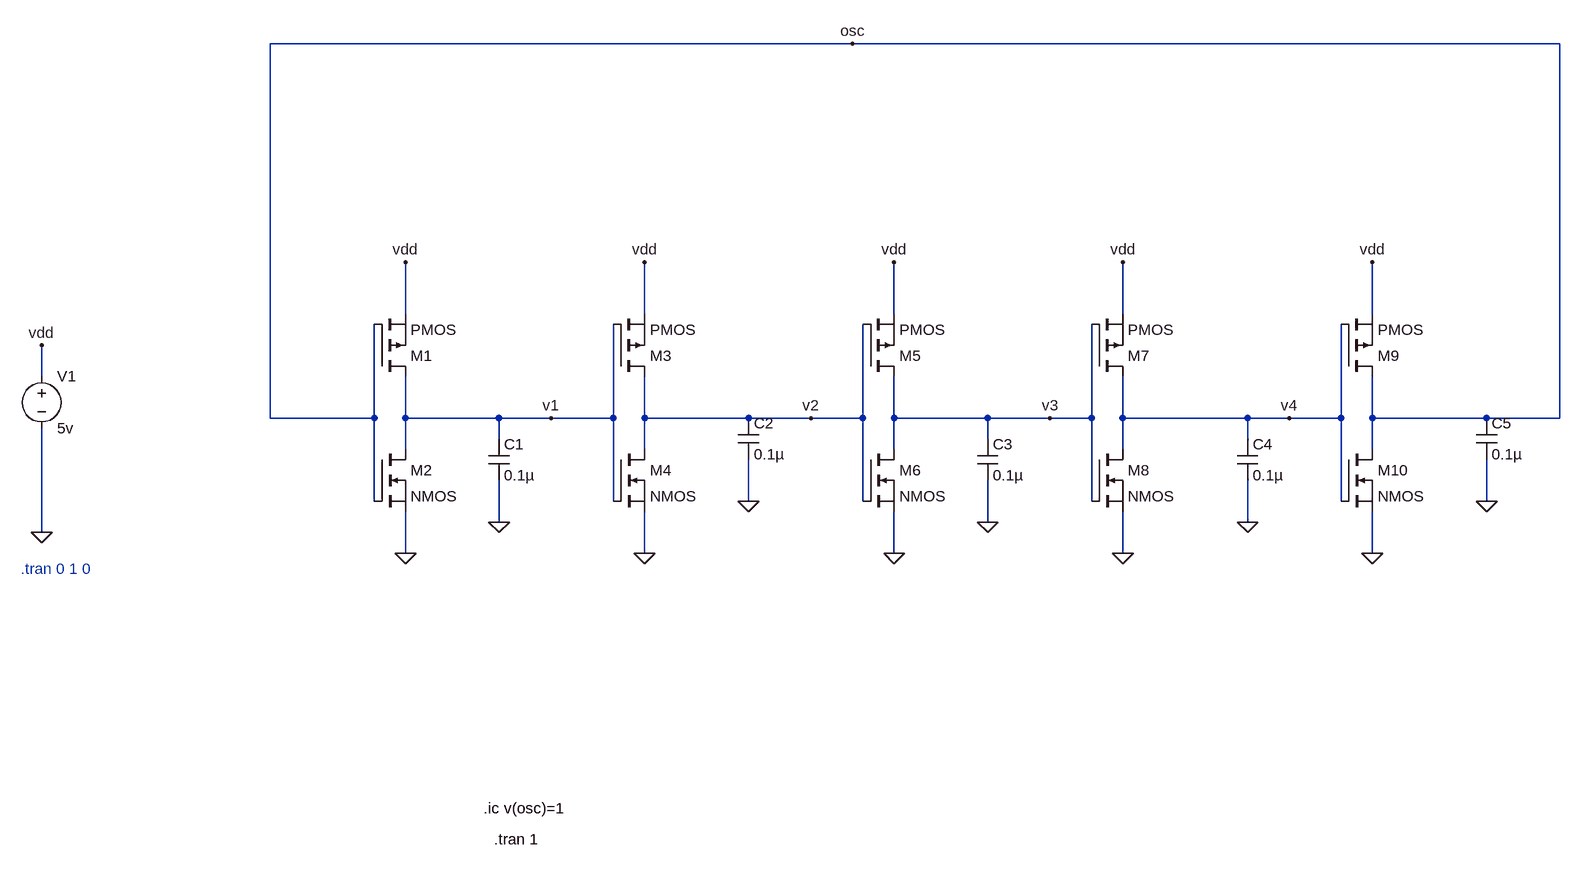
[diagram p0: schematic Ring Oscillator.asc]
Ring Oscillator.asc, the LTspice schematic file:
Version 4
SHEET 1 1428 980
WIRE 320 -384 -576 -384
WIRE 1408 -384 320 -384
WIRE -368 32 -368 -48
WIRE 0 32 0 -48
WIRE 384 32 384 -48
WIRE 736 32 736 -48
WIRE 1120 32 1120 -48
WIRE -928 128 -928 80
WIRE -576 192 -576 -384
WIRE -416 192 -416 48
WIRE -416 192 -576 192
WIRE -368 192 -368 128
WIRE -224 192 -368 192
WIRE -144 192 -224 192
WIRE -48 192 -48 48
WIRE -48 192 -144 192
WIRE 0 192 0 128
WIRE 160 192 0 192
WIRE 256 192 160 192
WIRE 336 192 336 48
WIRE 336 192 256 192
WIRE 384 192 384 128
WIRE 528 192 384 192
WIRE 624 192 528 192
WIRE 688 192 688 48
WIRE 688 192 624 192
WIRE 736 192 736 128
WIRE 928 192 736 192
WIRE 992 192 928 192
WIRE 1072 192 1072 48
WIRE 1072 192 992 192
WIRE 1120 192 1120 128
WIRE 1296 192 1120 192
WIRE 1408 192 1408 -384
WIRE 1408 192 1296 192
WIRE -224 224 -224 192
WIRE 528 224 528 192
WIRE 928 224 928 192
WIRE -368 240 -368 192
WIRE 0 240 0 192
WIRE 384 240 384 192
WIRE 736 240 736 192
WIRE 1120 240 1120 192
WIRE -416 320 -416 192
WIRE -48 320 -48 192
WIRE 160 320 160 256
WIRE 336 320 336 192
WIRE 688 320 688 192
WIRE 1072 320 1072 192
WIRE 1296 320 1296 256
WIRE -224 352 -224 288
WIRE 528 352 528 288
WIRE 928 352 928 288
WIRE -928 368 -928 208
WIRE -368 400 -368 336
WIRE 0 400 0 336
WIRE 384 400 384 336
WIRE 736 400 736 336
WIRE 1120 400 1120 336
FLAG -368 400 0
FLAG -368 -48 vdd
FLAG -928 368 0
FLAG 0 400 0
FLAG 0 -48 vdd
FLAG 384 400 0
FLAG 384 -48 vdd
FLAG 736 400 0
FLAG 736 -48 vdd
FLAG 1120 400 0
FLAG 1120 -48 vdd
FLAG -928 80 vdd
FLAG 320 -384 osc
FLAG -224 352 0
FLAG 160 320 0
FLAG 528 352 0
FLAG 928 352 0
FLAG 1296 320 0
FLAG -144 192 v1
FLAG 256 192 v2
FLAG 624 192 v3
FLAG 992 192 v4
SYMBOL pmos -416 128 M180
SYMATTR InstName M1
SYMBOL nmos -416 240 R0
SYMATTR InstName M2
SYMBOL voltage -928 112 R0
WINDOW 123 0 0 Left 0
WINDOW 39 0 0 Left 0
SYMATTR InstName V1
SYMATTR Value 5v
SYMBOL pmos -48 128 M180
SYMATTR InstName M3
SYMBOL nmos -48 240 R0
SYMATTR InstName M4
SYMBOL pmos 336 128 M180
SYMATTR InstName M5
SYMBOL nmos 336 240 R0
SYMATTR InstName M6
SYMBOL pmos 688 128 M180
SYMATTR InstName M7
SYMBOL nmos 688 240 R0
SYMATTR InstName M8
SYMBOL pmos 1072 128 M180
SYMATTR InstName M9
SYMBOL nmos 1072 240 R0
SYMATTR InstName M10
SYMBOL cap -240 224 R0
SYMATTR InstName C1
SYMATTR Value 0.1µ
SYMBOL cap 144 192 R0
SYMATTR InstName C2
SYMATTR Value 0.1µ
SYMBOL cap 512 224 R0
SYMATTR InstName C3
SYMATTR Value 0.1µ
SYMBOL cap 912 224 R0
SYMATTR InstName C4
SYMATTR Value 0.1µ
SYMBOL cap 1280 192 R0
SYMATTR InstName C5
SYMATTR Value 0.1µ
TEXT -960 424 Left 2 ;.tran 0 1 0
TEXT -248 792 Left 2 !.ic v(osc)=1
TEXT -232 840 Left 2 !.tran 1

The netlist it stands for:
* Ring Oscillator.asc
M1 v1 osc vdd vdd PMOS
M2 v1 osc 0 0 NMOS
V1 vdd 0 5v
M3 v2 v1 vdd vdd PMOS
M4 v2 v1 0 0 NMOS
M5 v3 v2 vdd vdd PMOS
M6 v3 v2 0 0 NMOS
M7 v4 v3 vdd vdd PMOS
M8 v4 v3 0 0 NMOS
M9 osc v4 vdd vdd PMOS
M10 osc v4 0 0 NMOS
C1 v1 0 0.1µ
C2 v2 0 0.1µ
C3 v3 0 0.1µ
C4 v4 0 0.1µ
C5 osc 0 0.1µ
.model NMOS NMOS
.model PMOS PMOS
.lib standard.mos
* .tran 0 1 0
.ic v(osc)=1
.tran 1
.backanno
.end